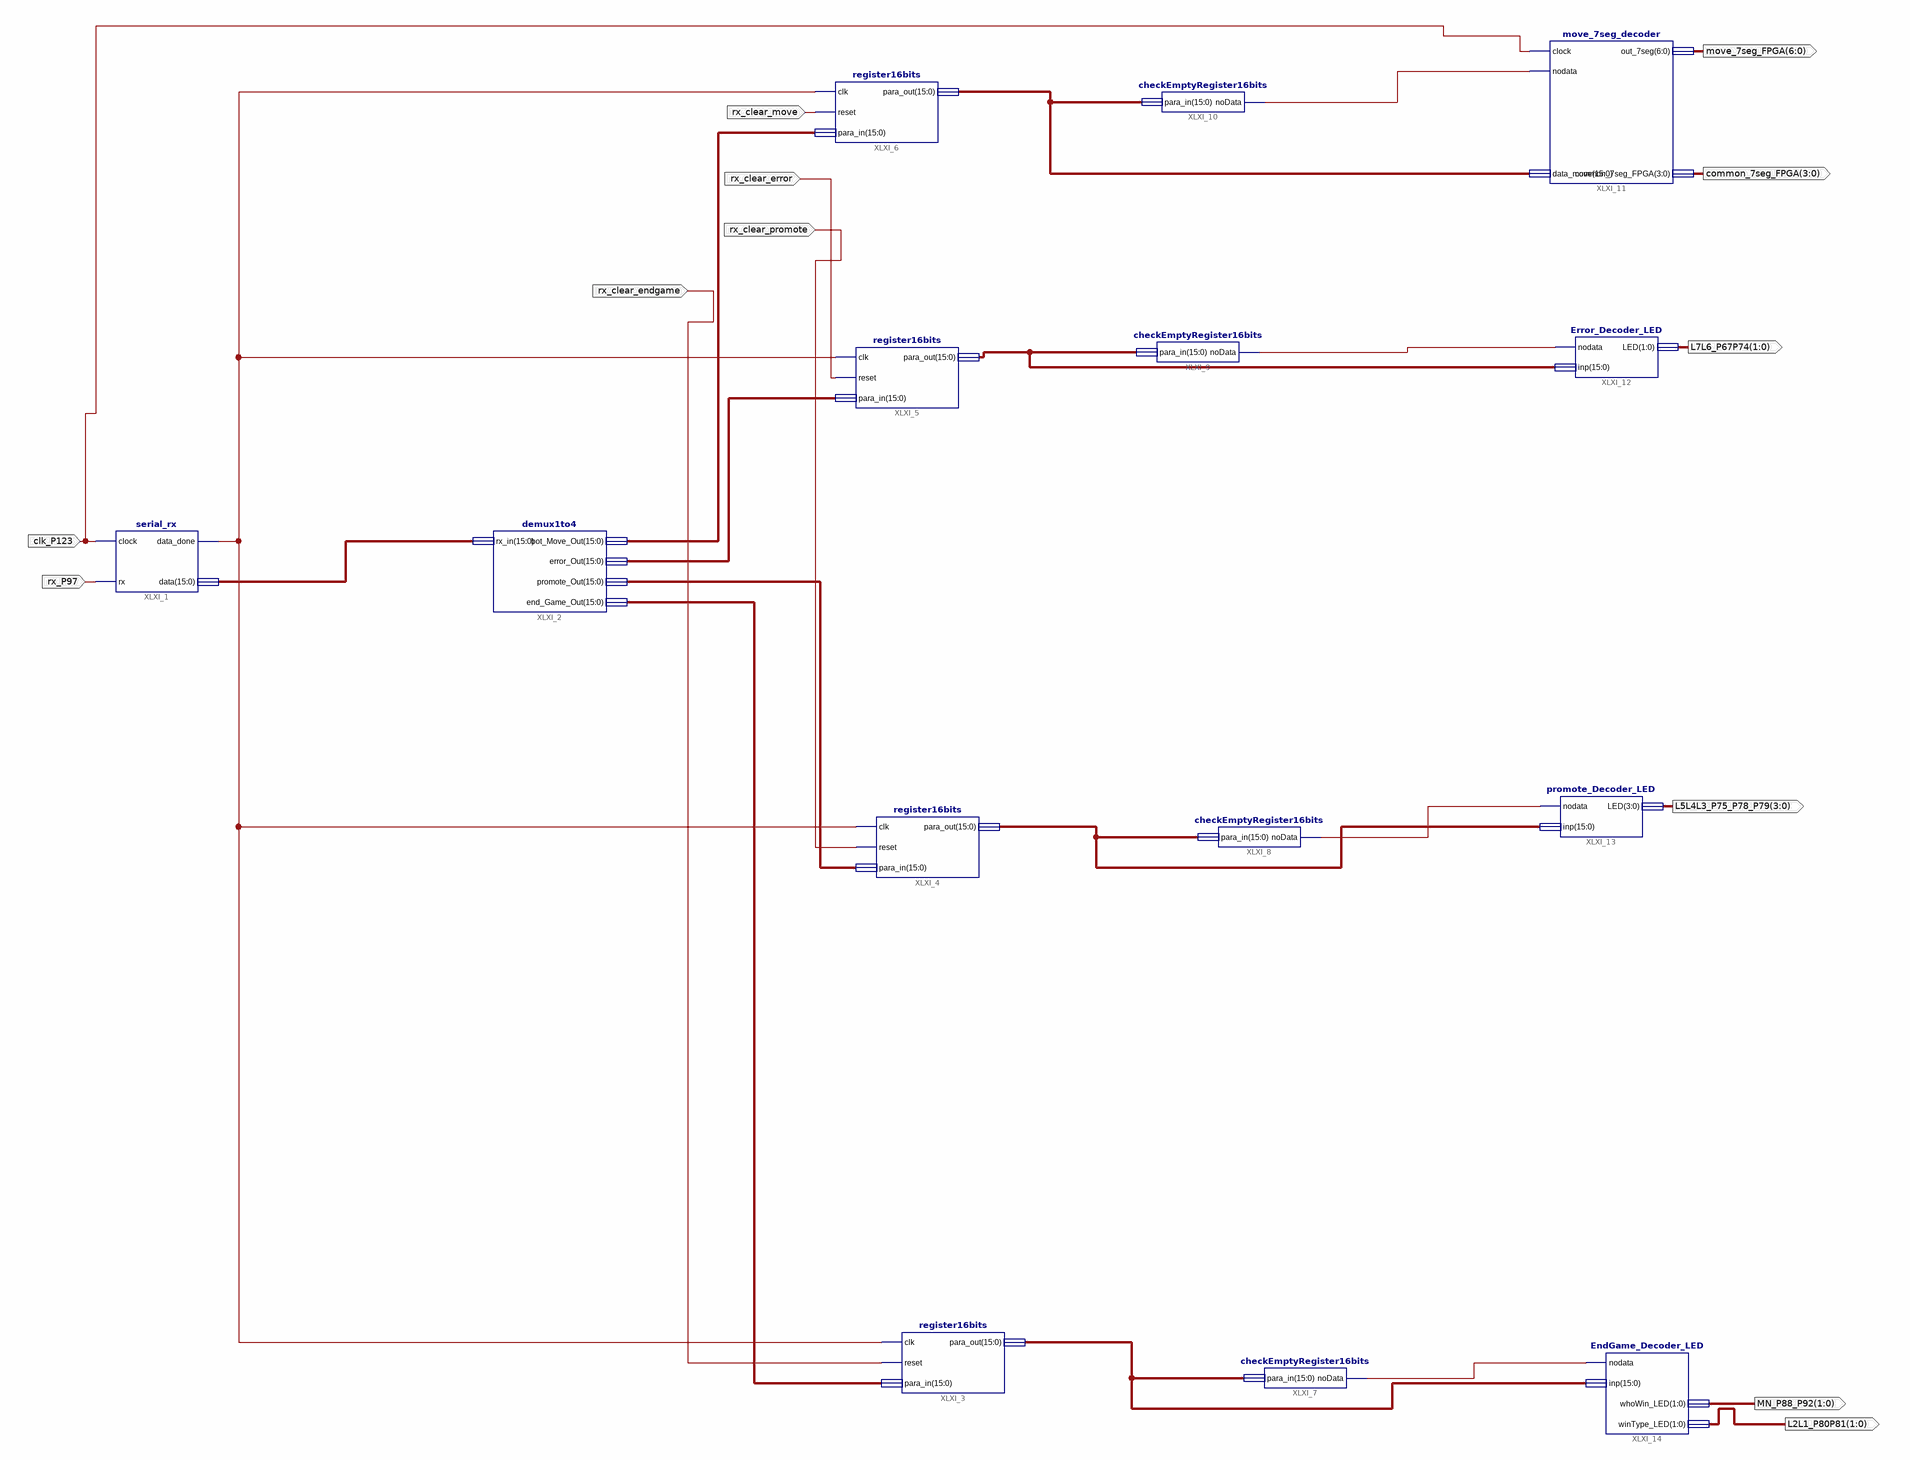
[diagram p0: schematic sheet 1]
// Xilinx ISE schematic rx_To_Display.sch (spartan6) as structural Verilog: 14 symbols, 12 ports
module rx_To_Display (
  input  clk_P123,
  input  rx_P97,
  input  rx_clear_move,
  input  rx_clear_error,
  input  rx_clear_promote,
  input  rx_clear_endgame,
  output [6:0] move_7seg_FPGA,
  output [3:0] common_7seg_FPGA,
  output [1:0] L7L6_P67P74,
  output [3:0] L5L4L3_P75_P78_P79,
  output [1:0] L2L1_P80P81,
  output [1:0] MN_P88_P92
);

  wire XLXN_11, XLXN_15, XLXN_19, XLXN_22, XLXN_24;
  wire [15:0] XLXN_1, XLXN_5, XLXN_6, XLXN_8, XLXN_9, XLXN_16, XLXN_17, XLXN_21, XLXN_23;

  serial_rx XLXI_1 (.clock(clk_P123), .rx(rx_P97), .data_done(XLXN_11), .data(XLXN_1));
  demux1to4 XLXI_2 (
    .rx_in(XLXN_1), .bot_Move_Out(XLXN_5), .error_Out(XLXN_6), .promote_Out(XLXN_8), .end_Game_Out(XLXN_9));
  register16bits XLXI_3 (.clk(XLXN_11), .reset(rx_clear_endgame), .para_in(XLXN_9), .para_out(XLXN_23));
  register16bits XLXI_4 (.clk(XLXN_11), .reset(rx_clear_promote), .para_in(XLXN_8), .para_out(XLXN_21));
  register16bits XLXI_5 (.clk(XLXN_11), .reset(rx_clear_error), .para_in(XLXN_6), .para_out(XLXN_17));
  register16bits XLXI_6 (.clk(XLXN_11), .reset(rx_clear_move), .para_in(XLXN_5), .para_out(XLXN_16));
  checkEmptyRegister16bits XLXI_7 (.para_in(XLXN_23), .noData(XLXN_24));
  checkEmptyRegister16bits XLXI_8 (.para_in(XLXN_21), .noData(XLXN_22));
  checkEmptyRegister16bits XLXI_9 (.para_in(XLXN_17), .noData(XLXN_19));
  checkEmptyRegister16bits XLXI_10 (.para_in(XLXN_16), .noData(XLXN_15));
  move_7seg_decoder XLXI_11 (
    .clock(clk_P123), .nodata(XLXN_15), .data_move(XLXN_16), .out_7seg(move_7seg_FPGA),
    .common_7seg_FPGA(common_7seg_FPGA));
  Error_Decoder_LED XLXI_12 (.nodata(XLXN_19), .inp(XLXN_17), .LED(L7L6_P67P74));
  promote_Decoder_LED XLXI_13 (.nodata(XLXN_22), .inp(XLXN_21), .LED(L5L4L3_P75_P78_P79));
  EndGame_Decoder_LED XLXI_14 (.nodata(XLXN_24), .inp(XLXN_23), .whoWin_LED(MN_P88_P92), .winType_LED(L2L1_P80P81));
endmodule
